# Altium schematic sheet BoschIMU.SchDoc
size A4; SheetNumber: 3; SheetTotal: 6
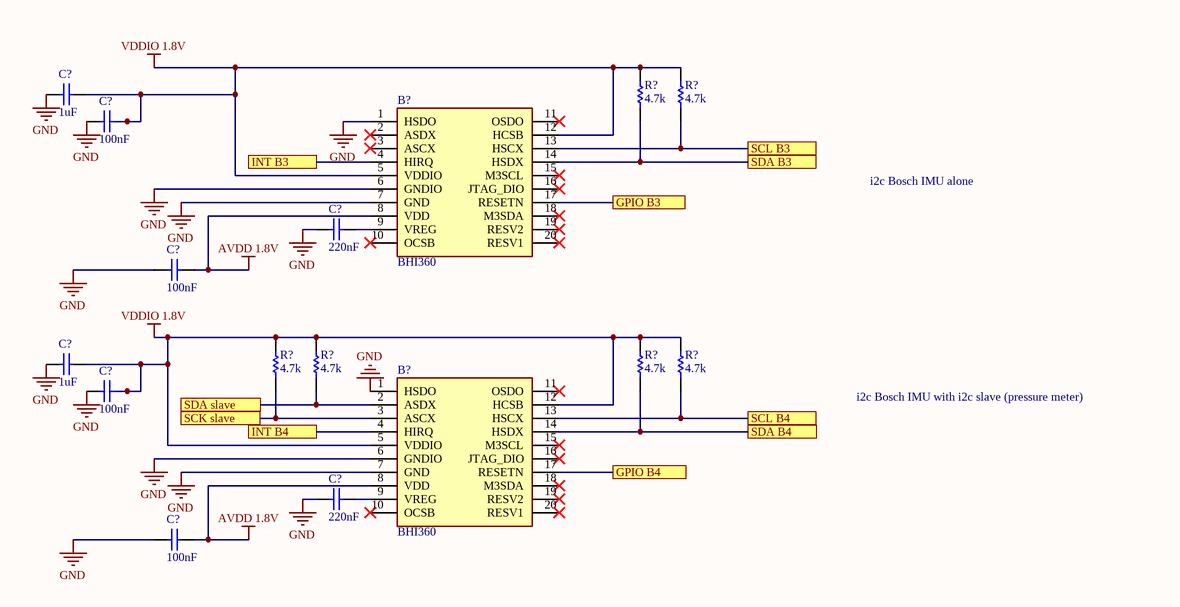
[diagram p0: BoschIMU.SchDoc]

## Parts
(Parts that share a designator on the sheet are numbered #1, #2 ... from top to bottom, then left to right.)
B?#1  BHI360  [BHI360]
B?#2  BHI360  [BHI360]
C?#1  value 1uF  (hidden comment: Capacitor)
C?#2  value 100nF  (hidden comment: Capacitor)
C?#3  value 220nF  (hidden comment: Capacitor)
C?#4  value 100nF  (hidden comment: Capacitor)
C?#5  value 1uF  (hidden comment: Capacitor)
C?#6  value 100nF  (hidden comment: Capacitor)
C?#7  value 220nF  (hidden comment: Capacitor)
C?#8  value 100nF  (hidden comment: Capacitor)
R?#1  value 4.7k  (hidden comment: Resistor)
R?#2  value 4.7k  (hidden comment: Resistor)
R?#3  value 4.7k  (hidden comment: Resistor)
R?#4  value 4.7k  (hidden comment: Resistor)
R?#5  value 4.7k  (hidden comment: Resistor)
R?#6  value 4.7k  (hidden comment: Resistor)

## Ports
GPIO B3, GPIO B4, INT B3, INT B4, SCK slave, SCL B3, SCL B4, SDA B3, SDA B4, SDA slave

## Nets
AVDD 1.8V: B?#1.8(VDD) B?#2.8(VDD) C?#4.2 C?#8.2
GND: B?#1.1(HSDO) B?#1.6(GNDIO) B?#1.7(GND) B?#2.1(HSDO) B?#2.6(GNDIO) B?#2.7(GND) C?#1.1 C?#2.1 C?#3.1 C?#4.1 C?#5.1 C?#6.1 C?#7.1 C?#8.1
VDDIO 1.8V: B?#1.5(VDDIO) B?#1.12(HCSB) B?#2.5(VDDIO) B?#2.12(HCSB) C?#1.2 C?#2.2 C?#5.2 C?#6.2 R?#1.2 R?#2.2 R?#3.2 R?#4.2 R?#5.2 R?#6.2
GPIO B3: B?#1.17(RESETN) ; port GPIO B3
GPIO B4: B?#2.17(RESETN) ; port GPIO B4
INT B3: B?#1.4(HIRQ) ; port INT B3
INT B4: B?#2.4(HIRQ) ; port INT B4
SCK slave: B?#2.3(ASCX) R?#3.1 ; port SCK slave
SCL B3: B?#1.13(HSCX) R?#2.1 ; port SCL B3
SCL B4: B?#2.13(HSCX) R?#6.1 ; port SCL B4
SDA B3: B?#1.14(HSDX) R?#1.1 ; port SDA B3
SDA B4: B?#2.14(HSDX) R?#5.1 ; port SDA B4
SDA slave: B?#2.2(ASDX) R?#4.1 ; port SDA slave
NetB?#1_9: B?#1.9(VREG) C?#3.2
NetB?#2_9: B?#2.9(VREG) C?#7.2

Not connected (* = marked no-connect by the designer): B?#1 2(ASDX)* 3(ASCX)* 10(OCSB)* 11(OSDO)* 15(M3SCL)* 16(JTAG_DIO)* 18(M3SDA)* 19(RESV2)* 20(RESV1)*; B?#2 10(OCSB)* 11(OSDO)* 15(M3SCL)* 16(JTAG_DIO)* 18(M3SDA)* 19(RESV2)* 20(RESV1)*

## Notes on the sheet
- i2c Bosch IMU alone
- i2c Bosch IMU with i2c slave (pressure meter)

## Library data of the parts
B?#1 B?#2 = BHI360: IMUs - Inertial Measurement Units Programmable smart sensor combining accelerometer, gyroscope and fusion software; Manufacturer_Name: BOSCH; Geometry.Height: 1mm; Mouser Part Number: 262-BHI360; Mouser Price/Stock: https://www.mouser.co.uk/ProductDetail/Bosch-Sensortec/BHI360?qs=ulEaXIWI0c93cz3Dqv%252BGgg%3D%3D; Manufacturer_Part_Number: BHI360; Datasheet Link: https://www.bosch-sensortec.com/media/boschsensortec/downloads/datasheets/bst-bhi360-ds000.pdf
C?#1-C?#8 = Capacitor: SimulationGenericComponent: True
R?#1-R?#6 = Resistor: TC1: 0; SimulationGenericComponent: True; TC2: 0